# EAGLE schematic v1 (EAGLE 7.3.0)
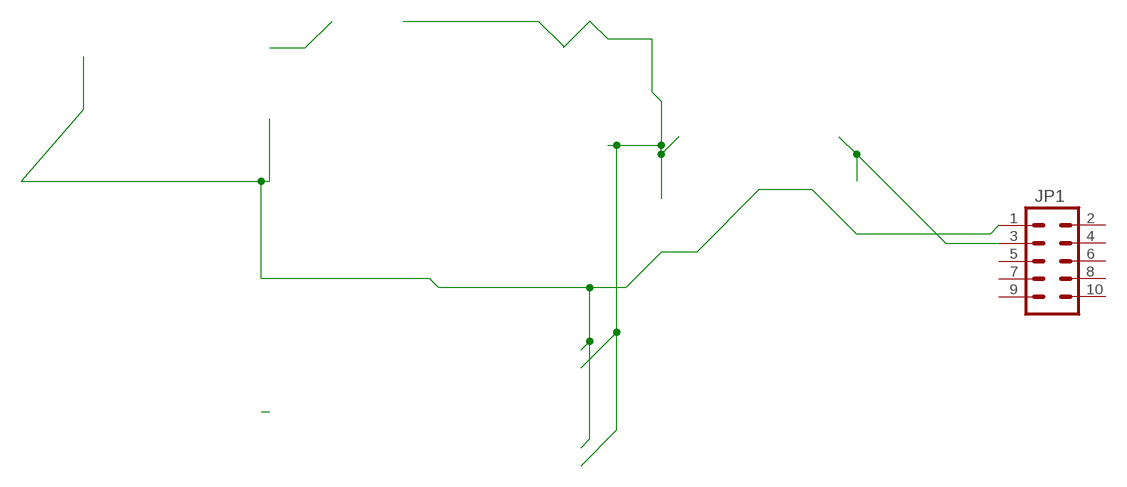
[diagram p0: schematic, sheet 1]

## Parts
JP1  M05X2PTH  [AVR_ICSP]

## Nets
GND: JP1.1
VDD: JP1.3
Unconnected: JP1.2 JP1.4 JP1.5 JP1.6 JP1.7 JP1.8 JP1.9 JP1.10

## Library data of the parts
JP1 = SparkFun-Connectors:M05X2: Header 5x2 Standard 10-pin dual row 0.1" header. Commonly used with AVR-ISP. Use with Spark Fun Electronics SKU: PRT-00778